# Altium project PCB_Project.PrjPcb (part 5 of 5)
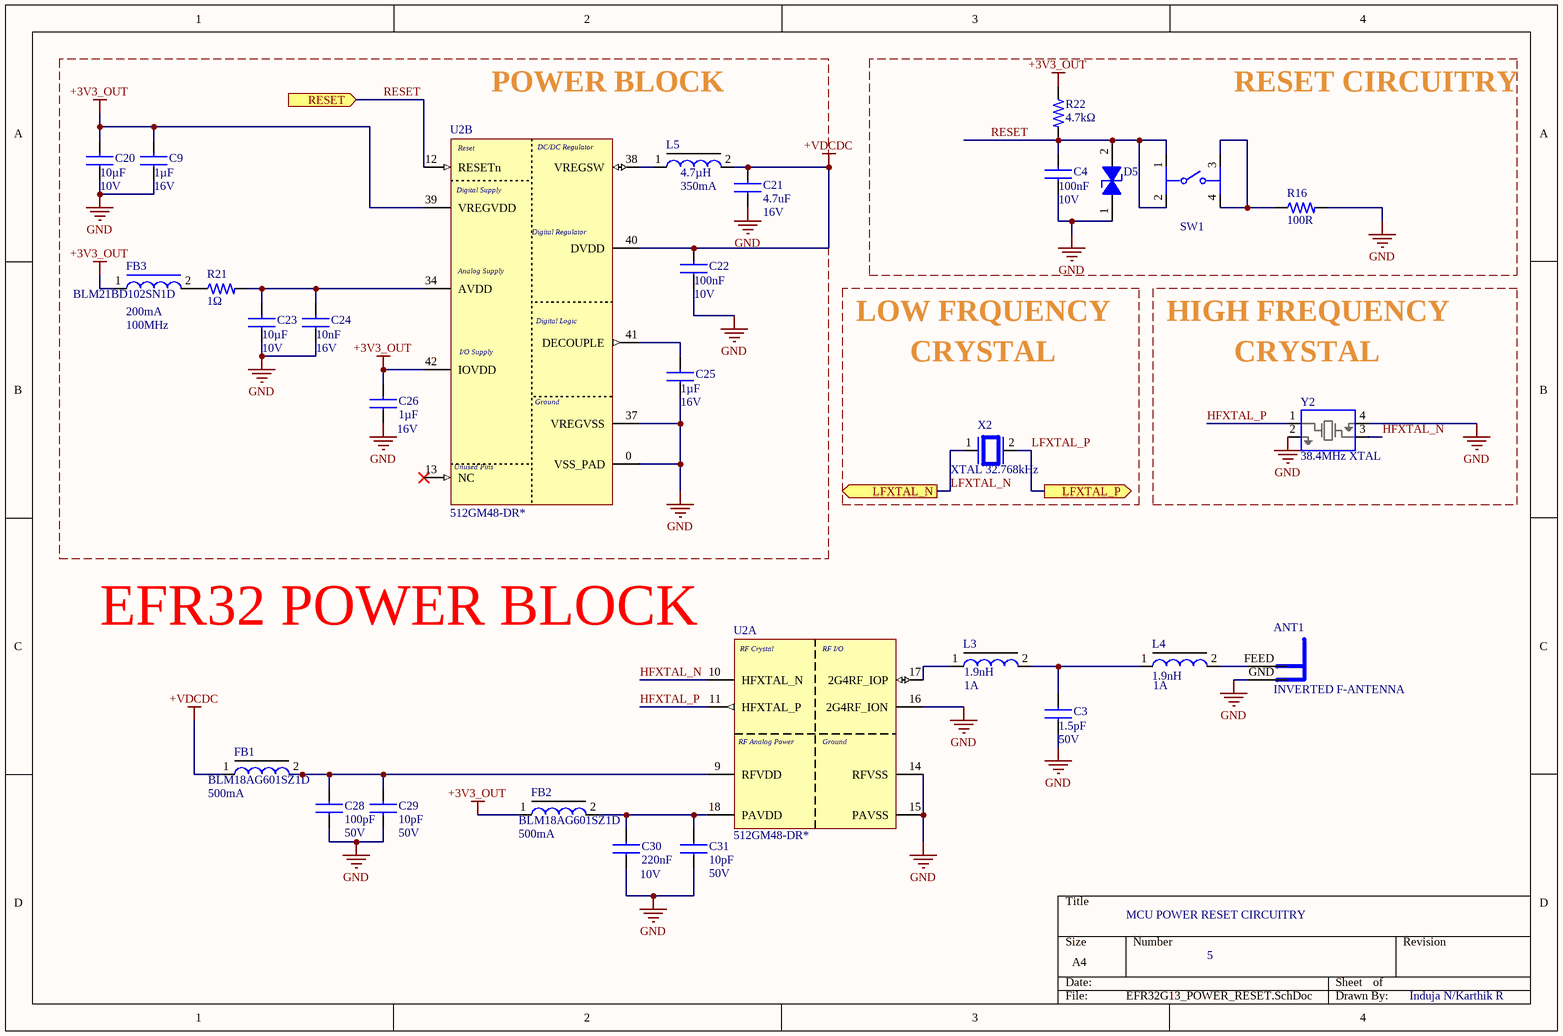
[diagram p10: EFR32G13_POWER_RESET.SchDoc]

## Sheet EFR32G13_POWER_RESET.SchDoc (continued)

### Library data of the parts (continued)
U2 = EFR32BG13P732F512GM48-DR: Blue Gecko QFN48 2.4 G 19 dB BLE/Proprietary 512 kB 64 kB(RAM) 31GPIO; Manufacturer: Silicon Labs; Manufacturer Lifecycle Status: FULL PRODUCTION; Flash Memory Size: 512kB; Max Supply Voltage: 3.8V; Min Supply Voltage: 1.8V; Number of Digital IO: 31; Number of I2C Channels: 2; Number of SPI Channels: 3; Number of UART Channels: 8; Number of USART Channels: 4; Operating Supply Voltage: 3.3V; RAM Size: 64kB; Supplier: DigiKey; Supplier Part Number: 336-EFR32BG13P732F512GM48-DRCT-ND; Manufacturer Part Number: EFR32BG13P732F512GM48-DR; RoHS: Compliant; Category: System on Chip (SoC); Stock: 8802; Pricing: 1=7.38, 10=6.396, 25=6.0548, 100=5.586, 250=5.30508, 500=5.10674, 1000=4.91994 (USD); Height - Seated (Max): 900µm; Length: 7mm; Lifecycle Status: Production; Max Operating Temperature: 85°C; Min Operating Temperature: -40°C; Number of GPIO: 31; Number of Terminals: 48; Terminal Pitch: 500µm; Width: 7mm; ComponentLink1URL: https://datasheet.octopart.com:443/EFR32BG13P732F512GM48-DR-Silicon-Labs-datasheet-180782262.pdf?src-supplier=IHS; ComponentLink1Description: https://datasheet.octopart.com:443/EFR32BG13P732F512GM48-DR-Silicon-Labs-datasheet-180782262.pdf?src-supplier=IHS; ComponentLink2URL: https://datasheet.octopart.com:443/EFR32BG13P732F512GM48-DR-Silicon-Labs-datasheet-150822224.pdf?src-supplier=Silicon+Labs; ComponentLink2Description: https://datasheet.octopart.com:443/EFR32BG13P732F512GM48-DR-Silicon-Labs-datasheet-150822224.pdf?src-supplier=Silicon+Labs; ComponentLink3URL: https://datasheet.octopart.com:443/EFR32BG13P732F512GM48-DR-Silicon-Labs-datasheet-142345357.pdf?src-supplier=Silicon+Labs+SCT; ComponentLink3Description: https://datasheet.octopart.com:443/EFR32BG13P732F512GM48-DR-Silicon-Labs-datasheet-142345357.pdf?src-supplier=Silicon+Labs+SCT; ComponentLink4URL: https://datasheet.octopart.com:443/EFR32BG13P732F512GM48-DR-Silicon-Labs-datasheet-150822225.pdf?src-supplier=Farnell; ComponentLink4Description: https://datasheet.octopart.com:443/EFR32BG13P732F512GM48-DR-Silicon-Labs-datasheet-150822225.pdf?src-supplier=Farnell
X2 = XTAL 32.768kHz: Crystal 0.032768MHz ±20ppm (Tol) 12.5pF Flexural 70000Ohm 2-Pin CSMD T/R; Manufacturer: Abracon; Manufacturer Part Number: ABS07-32.768KHZ-H-T; Additional Feature: TAPE AND REEL; Aging: 3 PPM/FIRST YEAR; Crystal/Resonator Type: PARALLEL - FUNDAMENTAL; Drive Level: 0.5uW; ESR: 70kR; Supplier: Mouser; Supplier Part Number: 535-ABS07-32.768KHZ-H-TTR-ND; RoHS: Yes; Category: Crystals; Stock: 349794; Pricing: 1=0.64, 10=0.502, 50=0.502, 100=0.463, 500=0.438, 1000=0.419, 3000=0.308, 6000=0.281, 9000=0.269, 10000=0.269, 24000=0.258 (USD); Mounting Technology: Surface Mount; Min Operating Temperature: -40°C; Max Operating Temperature: 85°C; Frequency Tolerance: 20ppm; Load Capacitance: 12.5pF; Operating Frequency-Nom: 0.032768; Reach SVHC Compliant: Yes; RoHS Compliant: Yes; ComponentLink1URL: https://datasheet.ciiva.com:443/pdfs/VipMasterIC/IC/ABRC/ABRC-S-A0006623177/ABRC-S-A0006623177-1.pdf?src-supplier=IHS+Markit; ComponentLink1Description: https://datasheet.ciiva.com:443/pdfs/VipMasterIC/IC/ABRC/ABRC-S-A0006623177/ABRC-S-A0006623177-1.pdf?src-supplier=IHS+Markit; ComponentLink2URL: https://datasheet.ciiva.com/854/abs07-854935.pdf?src-supplier=Digikey; ComponentLink2Description: https://datasheet.ciiva.com/854/abs07-854935.pdf?src-supplier=Digikey; ComponentLink3URL: https://datasheet.ciiva.com/854/abs07-854936.pdf?src-supplier=Digikey; ComponentLink3Description: https://datasheet.ciiva.com/854/abs07-854936.pdf?src-supplier=Digikey; ComponentLink4URL: https://datasheet.ciiva.com/854/abs07-854937.pdf?src-supplier=Digikey; ComponentLink4Description: https://datasheet.ciiva.com/854/abs07-854937.pdf?src-supplier=Digikey; ComponentLink5URL: https://datasheet.ciiva.com/15214/getdatasheetpartid-727011-15214954.pdf?src-supplier=Verical; ComponentLink5Description: https://datasheet.ciiva.com/15214/getdatasheetpartid-727011-15214954.pdf?src-supplier=Verical; ComponentLink6URL: https://datasheet.ciiva.com/7998/1912628-7998667.pdf?src-supplier=Element14; ComponentLink6Description: https://datasheet.ciiva.com/7998/1912628-7998667.pdf?src-supplier=Element14; Case/Package: CSMD; Pins: 2; Package Quantity: 3000; Tolerance: 20ppm; ESR (Equivalent Series Resistance): 70kR; Frequency: 32.768kHz; Packaging: Tape and Reel; Termination: SMD/SMT; Series: ABS07; Operating Frequency: 32.768 kHz; Length: 3.2mm; Width: 1.5mm; Height: 0.9mm; Depth: 1.5mm; Radiation Hardening: No; Lead Free: Lead Free; ComponentLink7URL: https://datasheet.ciiva.com/1357/1883680-1357319.pdf?src-supplier=Element14; ComponentLink7Description: https://datasheet.ciiva.com/1357/1883680-1357319.pdf?src-supplier=Element14; ComponentLink8URL: https://datasheet.ciiva.com/4944/abs07-11028-4944830.pdf?src-supplier=Mouser; ComponentLink8Description: https://datasheet.ciiva.com/4944/abs07-11028-4944830.pdf?src-supplier=Mouser; Supplier 1: DigiKey; Supplier Part Number 1: 535-ABS07-32.768KHZ-H-TCT-ND
Y2 = 38.4MHz XTAL: Fundamental Active RoHS Compliant MHz Crystal Crystal 10pF 0.022 0.55mm -20C~70C 80Ohm; Manufacturer: TXC; Manufacturer Part Number: 8Y38472012; Supplier: DigiKey; Supplier Part Number: 887-8Y38472012CT-ND; Category: Crystals; Stock: 5079; Pricing: 1=0.78, 10=0.674, 25=0.6372, 50=0.611, 100=0.5857, 250=0.55384, 500=0.53094, 1000=0.50897 (USD); Supplier 1: DigiKey; Supplier Part Number 1: 887-8Y38472012CT-ND

## Sheet COMMUNICATION.SchDoc
size A4; Author: Induja N/Karthik R; SheetNumber: 6; SheetTotal: 7
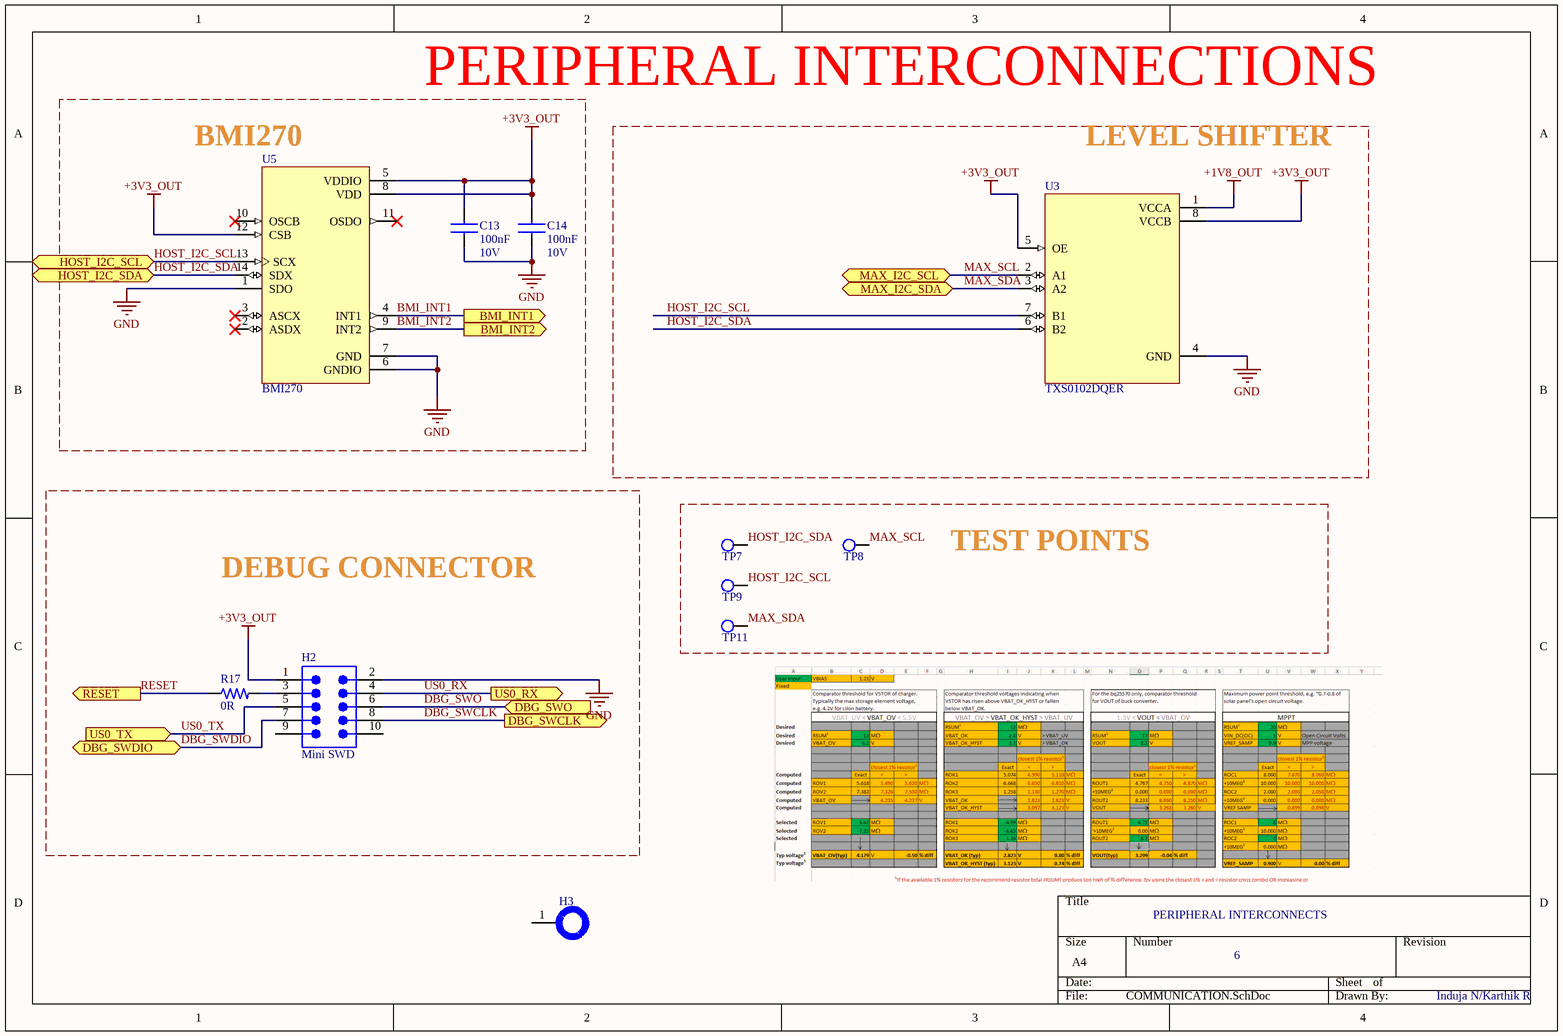
[diagram p5: COMMUNICATION.SchDoc]

### Parts
C13  value 100nF  Voltage Rating (DC): 10V  [CAP_0603_1MM]  (hidden comment: CAP 0.1uF 0603)
C14  value 100nF  Voltage Rating (DC): 10V  [CAP_0603_1MM]  (hidden comment: CAP 0.1uF 0603)
H2  Mini SWD  [FTSH-105-01-XXX-DV-K]
H3  (no value)  [PAD Hole]  (no BOM)
R17  value 0R  [RES_0603_1608X06]  (hidden comment: RES 0R 0603)
TP7  Test Point  [Test Point]  (value not drawn)  (net tie, no BOM)
TP8  Test Point  [Test Point]  (value not drawn)  (net tie, no BOM)
TP9  Test Point  [Test Point]  (value not drawn)  (net tie, no BOM)
TP11  Test Point  [Test Point]  (value not drawn)  (net tie, no BOM)
U3  TXS0102DQER  [SON35P140X100X40-8N]
U5  BMI270  [XDCR_BMI270]

### Blocks framed on the sheet
PERIPHERAL INTERCONNECTIONS: C13 C14 U5
LEVEL SHIFTER: U3
DEBUG CONNECTOR: H2 R17
TEST POINTS: TP7-TP9 TP11

### Ports
BMI_INT1 (out, see EFR32BG13_INTERCONNECTS[3C]), BMI_INT2 (out, see EFR32BG13_INTERCONNECTS[3C]), DBG_SWCLK (out, see EFR32BG13_INTERCONNECTS[3C]), DBG_SWDIO (bidir, see EFR32BG13_INTERCONNECTS[3C]), DBG_SWO (in, see EFR32BG13_INTERCONNECTS[3C]), HOST_I2C_SCL (bidir, see EFR32BG13_INTERCONNECTS[3B]), HOST_I2C_SDA (bidir, see EFR32BG13_INTERCONNECTS[3B]), MAX_I2C_SCL (bidir, see HEART_RATE[1B]), MAX_I2C_SDA (bidir, see HEART_RATE[1B]), RESET (out, see EFR32G13_POWER_RESET[1A]), US0_RX (out, see EFR32BG13_INTERCONNECTS[3C]), US0_TX (in, see EFR32BG13_INTERCONNECTS[3C])

### Nets
+1V8_OUT: U3.1(VCCA)
+3V3_OUT: C13.1 C14.1 H2.1 U3.5(OE) U3.8(VCCB) U5.5(VDDIO) U5.8(VDD) U5.12(CSB)
GND: C13.2 C14.2 H2.2 U3.4(GND) U5.1(SDO) U5.6(GNDIO) U5.7(GND)
BMI_INT1: U5.4(INT1) ; port BMI_INT1
BMI_INT2: U5.9(INT2) ; port BMI_INT2
DBG_SWCLK: H2.8 ; port DBG_SWCLK
DBG_SWDIO: H2.7 ; port DBG_SWDIO
DBG_SWO: H2.6 ; port DBG_SWO
HOST_I2C_SCL: TP9.1 U3.7(B1) U5.13(SCX) ; port HOST_I2C_SCL
HOST_I2C_SDA: TP7.1 U3.6(B2) U5.14(SDX) ; port HOST_I2C_SDA
MAX_SCL: TP8.1 U3.2(A1) ; port MAX_I2C_SCL
MAX_SDA: TP11.1 U3.3(A2) ; port MAX_I2C_SDA
RESET: R17.1 ; port RESET
US0_RX: H2.4 ; port US0_RX
US0_TX: H2.5 ; port US0_TX
NetH2_3: H2.3 R17.2

Not connected (* = marked no-connect by the designer): H2 9 10; H3 1; U5 2(ASDX)* 3(ASCX)* 10(OSCB)* 11(OSDO)*

### Notes on the sheet
- (near U5) BMI270
- PERIPHERAL INTERCONNECTS

### Library data of the parts
C13 C14 = CAP 0.1uF 0603: 0603 0.1 uF 10 V ±10% Tolerance X7R SMT Multilayer Ceramic Chip Capacitor; Manufacturer: Vishay; Manufacturer Part Number: VJ0603Y104KXQCW1BC; Supplier: Newark; Supplier Part Number: 77AK2911; RoHS: Compliant; Category: Ceramic Capacitors; Stock: 20000; Pricing: 4000=0.028, 8000=0.026 (USD); Case/Package: 0603; Case Code (Imperial): 0603; Case Code (Metric): 1608; China RoHS: Compliant; Depth: 800µm; Dielectric: X7R; Dielectric Material: Ceramic; Height: 870µm; Lead Free: Lead Free; Length: 1.6mm; Lifecycle Status: Production; Max Operating Temperature: 125°C; Min Operating Temperature: -55°C; Mounting Technology: Surface Mount; Number of Terminals: 2; REACH SVHC: Yes; Schedule B: 8532240020, 8532240020|8532240020|8532240020|8532240020|8532240020; Termination: SMD/SMT; Tolerance: 10%; Width: 800µm; ComponentLink1URL: https://datasheet.octopart.com:443/VJ0603Y104KXQCW1BC-Vishay-datasheet-182138897.pdf?src-supplier=IHS; ComponentLink1Description: https://datasheet.octopart.com:443/VJ0603Y104KXQCW1BC-Vishay-datasheet-182138897.pdf?src-supplier=IHS; ComponentLink2URL: https://datasheet.octopart.com:443/VJ0603Y104KXQCW1BC-Vishay-datasheet-182137611.pdf?src-supplier=IHS; ComponentLink2Description: https://datasheet.octopart.com:443/VJ0603Y104KXQCW1BC-Vishay-datasheet-182137611.pdf?src-supplier=IHS; ComponentLink3URL: https://datasheet.octopart.com:443/VJ0603Y104KXQCW1BC-Vishay-datasheet-79783898.pdf?src-supplier=Future+Electronics; ComponentLink3Description: https://datasheet.octopart.com:443/VJ0603Y104KXQCW1BC-Vishay-datasheet-79783898.pdf?src-supplier=Future+Electronics; ComponentLink4URL: https://datasheet.octopart.com/VJ0603Y104KXQCW1BC-Vishay-datasheet-13530908.pdf; ComponentLink4Description: https://datasheet.octopart.com/VJ0603Y104KXQCW1BC-Vishay-datasheet-13530908.pdf; ComponentLink5URL: https://datasheet.octopart.com/VJ0603Y104KXQCW1BC-Vishay-datasheet-13436109.pdf; ComponentLink5Description: https://datasheet.octopart.com/VJ0603Y104KXQCW1BC-Vishay-datasheet-13436109.pdf; ComponentLink6URL: https://datasheet.octopart.com/VJ0603Y104KXQCW1BC-Vishay-datasheet-13168783.pdf; ComponentLink6Description: https://datasheet.octopart.com/VJ0603Y104KXQCW1BC-Vishay-datasheet-13168783.pdf; ComponentLink7URL: https://datasheet.octopart.com/VJ0603Y104KXQCW1BC-Vishay-datasheet-13134009.pdf; ComponentLink7Description: https://datasheet.octopart.com/VJ0603Y104KXQCW1BC-Vishay-datasheet-13134009.pdf; ComponentLink8URL: https://datasheet.octopart.com/VJ0603Y104KXQCW1BC-Vishay-datasheet-13055807.pdf; ComponentLink8Description: https://datasheet.octopart.com/VJ0603Y104KXQCW1BC-Vishay-datasheet-13055807.pdf; ComponentLink9URL: https://datasheet.octopart.com/VJ0603Y104KXQCW1BC-Vishay-datasheet-13029350.pdf; ComponentLink9Description: https://datasheet.octopart.com/VJ0603Y104KXQCW1BC-Vishay-datasheet-13029350.pdf; ComponentLink10URL: https://datasheet.octopart.com/VJ0603Y104KXQCW1BC-Vishay-datasheet-12584848.pdf; ComponentLink10Description: https://datasheet.octopart.com/VJ0603Y104KXQCW1BC-Vishay-datasheet-12584848.pdf; ComponentLink11URL: https://datasheet.octopart.com/VJ0603Y104KXQCW1BC-Vishay-datasheet-12543093.pdf; ComponentLink11Description: https://datasheet.octopart.com/VJ0603Y104KXQCW1BC-Vishay-datasheet-12543093.pdf; ComponentLink12URL: https://datasheet.octopart.com/VJ0603Y104KXQCW1BC-Vishay-datasheet-12532924.pdf; ComponentLink12Description: https://datasheet.octopart.com/VJ0603Y104KXQCW1BC-Vishay-datasheet-12532924.pdf; ComponentLink13URL: https://datasheet.octopart.com/VJ0603Y104KXQCW1BC-Vishay-datasheet-12519409.pdf; ComponentLink13Description: https://datasheet.octopart.com/VJ0603Y104KXQCW1BC-Vishay-datasheet-12519409.pdf; ComponentLink14URL: https://datasheet.octopart.com/VJ0603Y104KXQCW1BC-Vishay-datasheet-12509873.pdf; ComponentLink14Description: https://datasheet.octopart.com/VJ0603Y104KXQCW1BC-Vishay-datasheet-12509873.pdf; ComponentLink15URL: http://sigma.octopart.com:80/rohs_statement/Vishay-company-15.pdf?src-supplier=Compliance+Statements; ComponentLink15Description: http://sigma.octopart.com:80/rohs_statement/Vishay-company-15.pdf?src-supplier=Compliance+Statements; Supplier 1: DigiKey; Supplier Part Number 1: 720-1689-1-ND
H2 = Debug Connector Mini SWD - 0.05": Mini SWD 0.05" Pitch Connector - 10 Pin SMT Box Header; Manufacturer: Adafruit Industries; Manufacturer Part Number: 4048; Supplier 1: Digi-Key; RoHS: No; Category: Connectors; Stock 1: 201; Pricing 1: 1=1.95000 (USD); ComponentLink1URL: https://media.digikey.com/pdf/Data%20Sheets/Adafruit%20PDFs/4048_Web.pdf?src-supplier=Digi-Key; ComponentLink1Description: https://media.digikey.com/pdf/Data%20Sheets/Adafruit%20PDFs/4048_Web.pdf?src-supplier=Digi-Key
H3 = PAD HOLE
R17 = RES 0R 0603: GENERAL PURPOSE CHIP RESISTOR Metal Glaze/thick Film, 0.1W, 0ohm, Surface Mount, 0603; Manufacturer: Yageo Group; Manufacturer Part Number: RC0603JR-070RL; Power Dissipation: 100mW; Temperature Coefficient: 200ppm/°C; Tolerance: 1%; Voltage Rating: 50V; Supplier: Newark; Supplier Part Number: 68X3182; RoHS: Compliant; Category: Chip SMD Resistors; Stock: 1605000; Pricing: 5000=0.003 (USD); Case/Package: 0603; Case Code (Imperial): 0603; China RoHS: Non-Compliant; Composition: Thick Film; Contact Plating: Tin; Depth: 800µm; Height: 450µm; Lead Free: Lead Free; Length: 1.6mm; Lifecycle Status: Production; Max Operating Temperature: 155°C; Military Standard: Not; Min Operating Temperature: -55°C; Mounting Technology: Surface Mount; Pins: 2; Number of Terminals: 2; Packaging: Cut Tape; Power Rating: 100mW; Radiation Hardening: No; REACH SVHC: Yes; Termination: SMD/SMT; Voltage Rating (DC): 50V; Width: 800µm; ComponentLink1URL: https://datasheet.octopart.com:443/RC0603JR-070RL-Yageo-datasheet-182189538.pdf?src-supplier=IHS; ComponentLink1Description: https://datasheet.octopart.com:443/RC0603JR-070RL-Yageo-datasheet-182189538.pdf?src-supplier=IHS; ComponentLink2URL: https://datasheet.octopart.com:443/RC0603JR-070RL-Yageo-datasheet-8328172.pdf?src-supplier=element14+APAC; ComponentLink2Description: https://datasheet.octopart.com:443/RC0603JR-070RL-Yageo-datasheet-8328172.pdf?src-supplier=element14+APAC; ComponentLink3URL: https://datasheet.octopart.com:443/RC0603JR-070RL-Yageo-datasheet-17842380.pdf?src-supplier=element14+APAC; ComponentLink3Description: https://datasheet.octopart.com:443/RC0603JR-070RL-Yageo-datasheet-17842380.pdf?src-supplier=element14+APAC; ComponentLink4URL: https://datasheet.octopart.com:443/RC0603JR-070RL-Yageo-datasheet-62067350.pdf?src-supplier=Farnell; ComponentLink4Description: https://datasheet.octopart.com:443/RC0603JR-070RL-Yageo-datasheet-62067350.pdf?src-supplier=Farnell; ComponentLink5URL: https://datasheet.octopart.com:443/RC0603JR-070RL-Yageo-datasheet-15599030.pdf?src-supplier=Future+Electronics; ComponentLink5Description: https://datasheet.octopart.com:443/RC0603JR-070RL-Yageo-datasheet-15599030.pdf?src-supplier=Future+Electronics; ComponentLink6URL: https://datasheet.octopart.com:443/RC0603JR-070RL-Yageo-datasheet-164759695.pdf?src-supplier=Future+Electronics; ComponentLink6Description: https://datasheet.octopart.com:443/RC0603JR-070RL-Yageo-datasheet-164759695.pdf?src-supplier=Future+Electronics; ComponentLink7URL: https://datasheet.octopart.com:443/RC0603JR-070RL-Yageo-datasheet-137700087.pdf?src-supplier=Future+Electronics; ComponentLink7Description: https://datasheet.octopart.com:443/RC0603JR-070RL-Yageo-datasheet-137700087.pdf?src-supplier=Future+Electronics; ComponentLink8URL: https://datasheet.octopart.com:443/RC0603JR-070RL-Yageo-datasheet-27584510.pdf?src-supplier=Future+Electronics; ComponentLink8Description: https://datasheet.octopart.com:443/RC0603JR-070RL-Yageo-datasheet-27584510.pdf?src-supplier=Future+Electronics; ComponentLink9URL: https://datasheet.octopart.com:443/RC0603JR-070RL-Yageo-datasheet-503470.pdf?src-supplier=Future+Electronics; ComponentLink9Description: https://datasheet.octopart.com:443/RC0603JR-070RL-Yageo-datasheet-503470.pdf?src-supplier=Future+Electronics; ComponentLink10URL: https://datasheet.octopart.com:443/RC0603JR-070RL-Yageo-datasheet-12596169.pdf?src-supplier=Newark; ComponentLink10Description: https://datasheet.octopart.com:443/RC0603JR-070RL-Yageo-datasheet-12596169.pdf?src-supplier=Newark; ComponentLink11URL: https://datasheet.octopart.com:443/RC0603JR-070RL-Yageo-datasheet-34211833.pdf?src-supplier=Newark; ComponentLink11Description: https://datasheet.octopart.com:443/RC0603JR-070RL-Yageo-datasheet-34211833.pdf?src-supplier=Newark; ComponentLink12URL: https://datasheet.octopart.com:443/RC0603JR-070RL-Yageo-datasheet-79472498.pdf?src-supplier=Megastar; ComponentLink12Description: https://datasheet.octopart.com:443/RC0603JR-070RL-Yageo-datasheet-79472498.pdf?src-supplier=Megastar; ComponentLink13URL: https://datasheet.octopart.com/RC0603JR-070RL-Yageo-datasheet-73766026.pdf; ComponentLink13Description: https://datasheet.octopart.com/RC0603JR-070RL-Yageo-datasheet-73766026.pdf; ComponentLink14URL: https://datasheet.octopart.com:443/RC0603JR-070RL-Yageo-datasheet-5393049.pdf?src-supplier=element14; ComponentLink14Description: https://datasheet.octopart.com:443/RC0603JR-070RL-Yageo-datasheet-5393049.pdf?src-supplier=element14; ComponentLink15URL: https://datasheet.octopart.com:443/RC0603JR-070RL-Yageo-datasheet-118562.pdf?src-supplier=DigiKey; ComponentLink15Description: https://datasheet.octopart.com:443/RC0603JR-070RL-Yageo-datasheet-118562.pdf?src-supplier=DigiKey; ComponentLink16URL: http://sigma.octopart.com:80/rohs_statement/Yageo-company-2.pdf?src-supplier=Compliance+Statements; ComponentLink16Description: http://sigma.octopart.com:80/rohs_statement/Yageo-company-2.pdf?src-supplier=Compliance+Statements; ComponentLink17URL: http://sigma.octopart.com:80/conflict_mineral_statement/Yageo-company-3.pdf?src-supplier=Compliance+Statements; ComponentLink17Description: http://sigma.octopart.com:80/conflict_mineral_statement/Yageo-company-3.pdf?src-supplier=Compliance+Statements; Supplier 1: DigiKey; Supplier Part Number 1: RMCF0603ZT0R00TR-ND
U3 = TXS0102DQER: 2-Bit Bidirectional Voltage-Level Shifter for Open-Drain and Push-Pull Application; MF: Texas Instruments; SnapEDA_Link: https://www.snapeda.com/parts/TXS0102DQER/Texas+Instruments/view-part/?ref=snap; Package: X2SON-8 Texas Instruments; Value: *; MP: TXS0102DQER; Check_prices: https://www.snapeda.com/parts/TXS0102DQER/Texas+Instruments/view-part/?ref=eda; Supplier 1: DigiKey; Supplier Part Number 1: 296-28368-1-ND
U5 = BMI270: Accelerometer, Gyroscope, 6 Axis Sensor IÂ²C, SPI Output; MF: Bosch Sensortec; Digi-Key_Part_Number: 828-1091-2-ND; Check_prices: https://www.snapeda.com/parts/BMI270/Bosch+Sensortec/view-part/?ref=eda; MP: BMI270; Package: LGA-14 Bosch Sensortec; SnapEDA_Link: https://www.snapeda.com/parts/BMI270/Bosch+Sensortec/view-part/?ref=snap; Value: *; Purchase-URL: https://pricing.snapeda.com/search/part/BMI270/?ref=eda; Supplier 1: DigiKey; Supplier Part Number 1: 828-1091-1-ND

## Sheet EFR32BG13_INTERCONNECTS.SchDoc
size A4; Author: Induja N/Karthik R; SheetNumber: 7; SheetTotal: 7
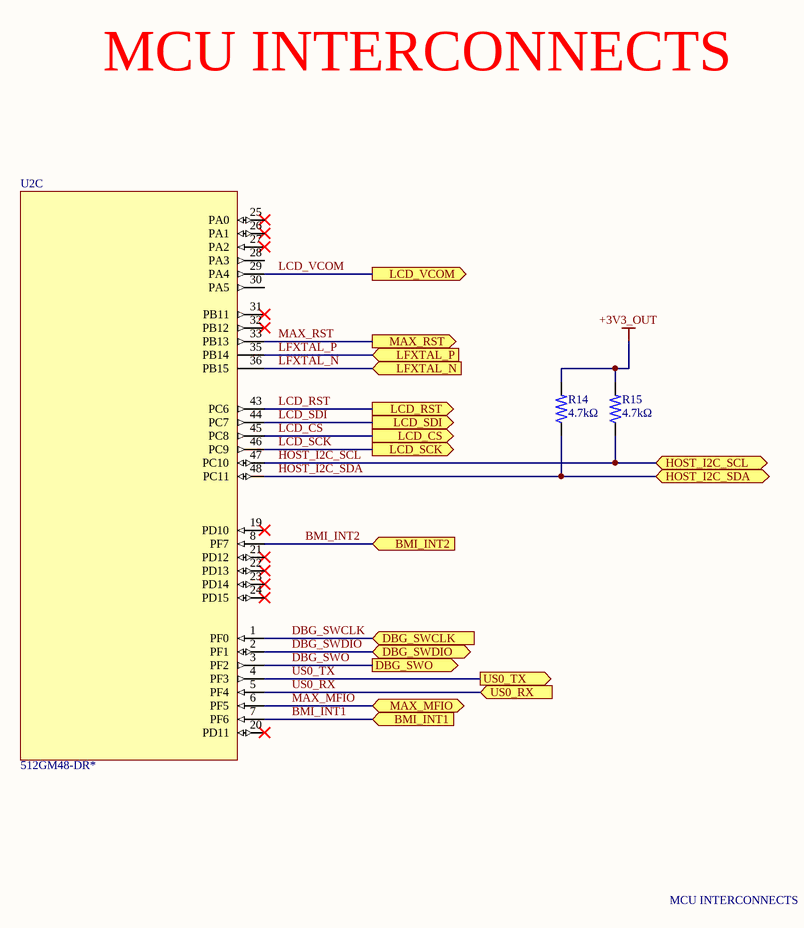
[diagram p6: EFR32BG13_INTERCONNECTS.SchDoc]

### Parts
R14  value 4.7kΩ  [RES_0603_1608X06]  (hidden comment: RES 4.7K 0603)
R15  value 4.7kΩ  [RES_0603_1608X06]  (hidden comment: RES 4.7K 0603)
U2  512GM48-DR*  [QFN_48_7x7]  (part C of 3)

### Ports
BMI_INT1 (in, see COMMUNICATION[2B]), BMI_INT2 (in, see COMMUNICATION[2B]), DBG_SWCLK (in, see COMMUNICATION[2C]), DBG_SWDIO (bidir, see COMMUNICATION[1C]), DBG_SWO (out, see COMMUNICATION[2C]), HOST_I2C_SCL (bidir, see COMMUNICATION[1B]), HOST_I2C_SDA (bidir, see COMMUNICATION[1B]), LCD_CS (out, see LCD[2B]), LCD_RST (out, see LCD[2B]), LCD_SCK (out, see LCD[2B]), LCD_SDI (out, see LCD[2B]), LCD_VCOM (out, see LCD[2B]), LFXTAL_N (in, see EFR32G13_POWER_RESET[3B]), LFXTAL_P (in, see EFR32G13_POWER_RESET[3B]), MAX_MFIO (bidir, see HEART_RATE[1B]), MAX_RST (out, see HEART_RATE[1B]), US0_RX (in, see COMMUNICATION[2C]), US0_TX (out, see COMMUNICATION[1C])

### Nets
+3V3_OUT: R14.2 R15.2
BMI_INT1: U2.7(PF6) ; port BMI_INT1
BMI_INT2: U2.8(PF7) ; port BMI_INT2
DBG_SWCLK: U2.1(PF0) ; port DBG_SWCLK
DBG_SWDIO: U2.2(PF1) ; port DBG_SWDIO
DBG_SWO: U2.3(PF2) ; port DBG_SWO
HOST_I2C_SCL: R15.1 U2.47(PC10) ; port HOST_I2C_SCL
HOST_I2C_SDA: R14.1 U2.48(PC11) ; port HOST_I2C_SDA
LCD_CS: U2.45(PC8) ; port LCD_CS
LCD_RST: U2.43(PC6) ; port LCD_RST
LCD_SCK: U2.46(PC9) ; port LCD_SCK
LCD_SDI: U2.44(PC7) ; port LCD_SDI
LCD_VCOM: U2.29(PA4) ; port LCD_VCOM
LFXTAL_N: U2.36(PB15) ; port LFXTAL_N
LFXTAL_P: U2.35(PB14) ; port LFXTAL_P
MAX_MFIO: U2.6(PF5) ; port MAX_MFIO
MAX_RST: U2.33(PB13) ; port MAX_RST
US0_RX: U2.5(PF4) ; port US0_RX
US0_TX: U2.4(PF3) ; port US0_TX

Not connected (* = marked no-connect by the designer): U2 19(PD10)* 20(PD11)* 21(PD12)* 22(PD13)* 23(PD14)* 24(PD15)* 25(PA0)* 26(PA1)* 27(PA2)* 28(PA3) 30(PA5) 31(PB11)* 32(PB12)*

### Notes on the sheet
- MCU INTERCONNECTS

### Library data of the parts
R14 R15 = RES 4.7K 0603: Fixed Resistor, Metal Glaze/thick Film, 0.1W, 4700ohm, 75V, 1% +/-Tol, 100ppm/Cel, Surface Mount, 0603; Manufacturer: Yageo; Manufacturer Part Number: RC0603FR-074K7L; Additional Feature: LASER TRIMMABLE; Power: 100mW; Rated Temperature: 70°C; Temperature Coefficient: 100ppm/°C; Package Height: 0.45mm; Package Length: 1.6mm; Package Width: 0.8mm; Supplier: Digikey; Supplier Part Number: 311-4.70KHRCT-ND; RoHS: Yes; Category: Chip SMD Resistors; Stock: 2101497; Pricing: 1=0.1, 10=0.019, 50=0.0112, 100=0.0093, 500=0.00622, 1000=0.00532, 5000=0.00382, 10000=0.00335, 25000=0.00287, 35000=0.00278, 50000=0.00257, 125000=0.00232 (USD); Mounting Technology: Surface Mount; Pins: 2; Package Shape: Rectangular; Case/Package: 0603; Terminal Finish: Nickel; Min Operating Temperature: -55°C; Max Operating Temperature: 155°C; Tolerance: 1%; JESD-609 Code: e3; Resistor Type: FIXED RESISTOR; Construction: Chip; Package Style: SMTMeter; Packaging: Tape and Reel; Technology: METAL GLAZE/THICK FILM; Termination: Wraparound; Working Voltage: 75V; Reach SVHC Compliant: Yes; RoHS Compliant: Yes; ComponentLink1URL: https://datasheet.ciiva.com:443/pdfs/VipMasterIC/IC/YAGO/YAGO-S-A0008145938/YAGO-S-A0008145938-1.pdf?src-supplier=IHS+Markit; ComponentLink1Description: https://datasheet.ciiva.com:443/pdfs/VipMasterIC/IC/YAGO/YAGO-S-A0008145938/YAGO-S-A0008145938-1.pdf?src-supplier=IHS+Markit; ComponentLink2URL: https://datasheet.ciiva.com/46440/1868787-46440909.pdf?src-supplier=Element14; ComponentLink2Description: https://datasheet.ciiva.com/46440/1868787-46440909.pdf?src-supplier=Element14; ComponentLink3URL: https://datasheet.ciiva.com/7660/38590-7660794.pdf?src-supplier=Element14; ComponentLink3Description: https://datasheet.ciiva.com/7660/38590-7660794.pdf?src-supplier=Element14; ComponentLink4URL: https://datasheet.ciiva.com/7746/1868787-7746365.pdf?src-supplier=Element14; ComponentLink4Description: https://datasheet.ciiva.com/7746/1868787-7746365.pdf?src-supplier=Element14; ComponentLink5URL: https://datasheet.ciiva.com/7746/1738695-7746366.pdf?src-supplier=Element14; ComponentLink5Description: https://datasheet.ciiva.com/7746/1738695-7746366.pdf?src-supplier=Element14; ComponentLink6URL: https://datasheet.ciiva.com/22747/443971-22747528.pdf?src-supplier=Element14; ComponentLink6Description: https://datasheet.ciiva.com/22747/443971-22747528.pdf?src-supplier=Element14; Supplier 1: DigiKey; Supplier Part Number 1: 311-4.70KHRDKR-ND
U2 = EFR32BG13P732F512GM48-DR: as U2 on sheet EFR32G13_POWER_RESET; Supplier: DigiKey; Supplier Part Number: 336-EFR32BG13P732F512GM48-DRCT-ND; Manufacturer Part Number: EFR32BG13P732F512GM48-DR; RoHS: Compliant; Category: System on Chip (SoC); Stock: 8802; Pricing: 1=7.38, 10=6.396, 25=6.0548, 100=5.586, 250=5.30508, 500=5.10674, 1000=4.91994 (USD); Height - Seated (Max): 900µm; Length: 7mm; Lifecycle Status: Production; Max Operating Temperature: 85°C; Min Operating Temperature: -40°C; Number of GPIO: 31; Number of Terminals: 48; Terminal Pitch: 500µm; Width: 7mm; ComponentLink1URL: https://datasheet.octopart.com:443/EFR32BG13P732F512GM48-DR-Silicon-Labs-datasheet-180782262.pdf?src-supplier=IHS; ComponentLink1Description: https://datasheet.octopart.com:443/EFR32BG13P732F512GM48-DR-Silicon-Labs-datasheet-180782262.pdf?src-supplier=IHS; ComponentLink2URL: https://datasheet.octopart.com:443/EFR32BG13P732F512GM48-DR-Silicon-Labs-datasheet-150822224.pdf?src-supplier=Silicon+Labs; ComponentLink2Description: https://datasheet.octopart.com:443/EFR32BG13P732F512GM48-DR-Silicon-Labs-datasheet-150822224.pdf?src-supplier=Silicon+Labs; ComponentLink3URL: https://datasheet.octopart.com:443/EFR32BG13P732F512GM48-DR-Silicon-Labs-datasheet-142345357.pdf?src-supplier=Silicon+Labs+SCT; ComponentLink3Description: https://datasheet.octopart.com:443/EFR32BG13P732F512GM48-DR-Silicon-Labs-datasheet-142345357.pdf?src-supplier=Silicon+Labs+SCT; ComponentLink4URL: https://datasheet.octopart.com:443/EFR32BG13P732F512GM48-DR-Silicon-Labs-datasheet-150822225.pdf?src-supplier=Farnell; ComponentLink4Description: https://datasheet.octopart.com:443/EFR32BG13P732F512GM48-DR-Silicon-Labs-datasheet-150822225.pdf?src-supplier=Farnell

## Nets that join several sheets
+1V8_OUT: POWER_BLOCK (C10.1 TP4.1 U1.7), HEART_RATE (10 pins), COMMUNICATION (U3.1)
+3V3_OUT: POWER_BLOCK (6 pins), LCD (D6.2 J3.1 J3.8), EFR32G13_POWER_RESET (8 pins), COMMUNICATION (8 pins), EFR32BG13_INTERCONNECTS (R14.2 R15.2)
+5V_USB: POWER_BLOCK (D3.1 D4.2 J1.A9 TP3.1), HEART_RATE (C19.1 U7.9 U7.10)
GND: POWER_BLOCK (29 pins), HEART_RATE (21 pins), LCD (D6.1 J3.2 J3.7), EFR32G13_POWER_RESET (24 pins), COMMUNICATION (7 pins)
BMI_INT1: COMMUNICATION (U5.4), EFR32BG13_INTERCONNECTS (U2.7)
BMI_INT2: COMMUNICATION (U5.9), EFR32BG13_INTERCONNECTS (U2.8)
DBG_SWCLK: COMMUNICATION (H2.8), EFR32BG13_INTERCONNECTS (U2.1)
DBG_SWDIO: COMMUNICATION (H2.7), EFR32BG13_INTERCONNECTS (U2.2)
DBG_SWO: COMMUNICATION (H2.6), EFR32BG13_INTERCONNECTS (U2.3)
HOST_I2C_SCL: COMMUNICATION (TP9.1 U3.7 U5.13), EFR32BG13_INTERCONNECTS (R15.1 U2.47)
HOST_I2C_SDA: COMMUNICATION (TP7.1 U3.6 U5.14), EFR32BG13_INTERCONNECTS (R14.1 U2.48)
LCD_CS: LCD (J3.4), EFR32BG13_INTERCONNECTS (U2.45)
LCD_RST: LCD (J3.6), EFR32BG13_INTERCONNECTS (U2.43)
LCD_SCK: LCD (J3.3), EFR32BG13_INTERCONNECTS (U2.46)
LCD_SDI: LCD (J3.5), EFR32BG13_INTERCONNECTS (U2.44)
LCD_VCOM: LCD (J3.9), EFR32BG13_INTERCONNECTS (U2.29)
LFXTAL_N: EFR32G13_POWER_RESET (X2.1), EFR32BG13_INTERCONNECTS (U2.36)
LFXTAL_P: EFR32G13_POWER_RESET (X2.2), EFR32BG13_INTERCONNECTS (U2.35)
MAX_MFIO: HEART_RATE (TP17.1 U6.1), EFR32BG13_INTERCONNECTS (U2.6)
MAX_RST: HEART_RATE (C2.1 TP16.1 U6.6), EFR32BG13_INTERCONNECTS (U2.33)
MAX_SCL: HEART_RATE (U6.24), COMMUNICATION (TP8.1 U3.2)
MAX_SDA: HEART_RATE (U6.23), COMMUNICATION (TP11.1 U3.3)
RESET: EFR32G13_POWER_RESET (6 pins), COMMUNICATION (R17.1)
US0_RX: COMMUNICATION (H2.4), EFR32BG13_INTERCONNECTS (U2.5)
US0_TX: COMMUNICATION (H2.5), EFR32BG13_INTERCONNECTS (U2.4)